# Altium schematic sheet BCR.SchDoc
size A2; Author: H. Chesser; DrawnBy: H. Chesser
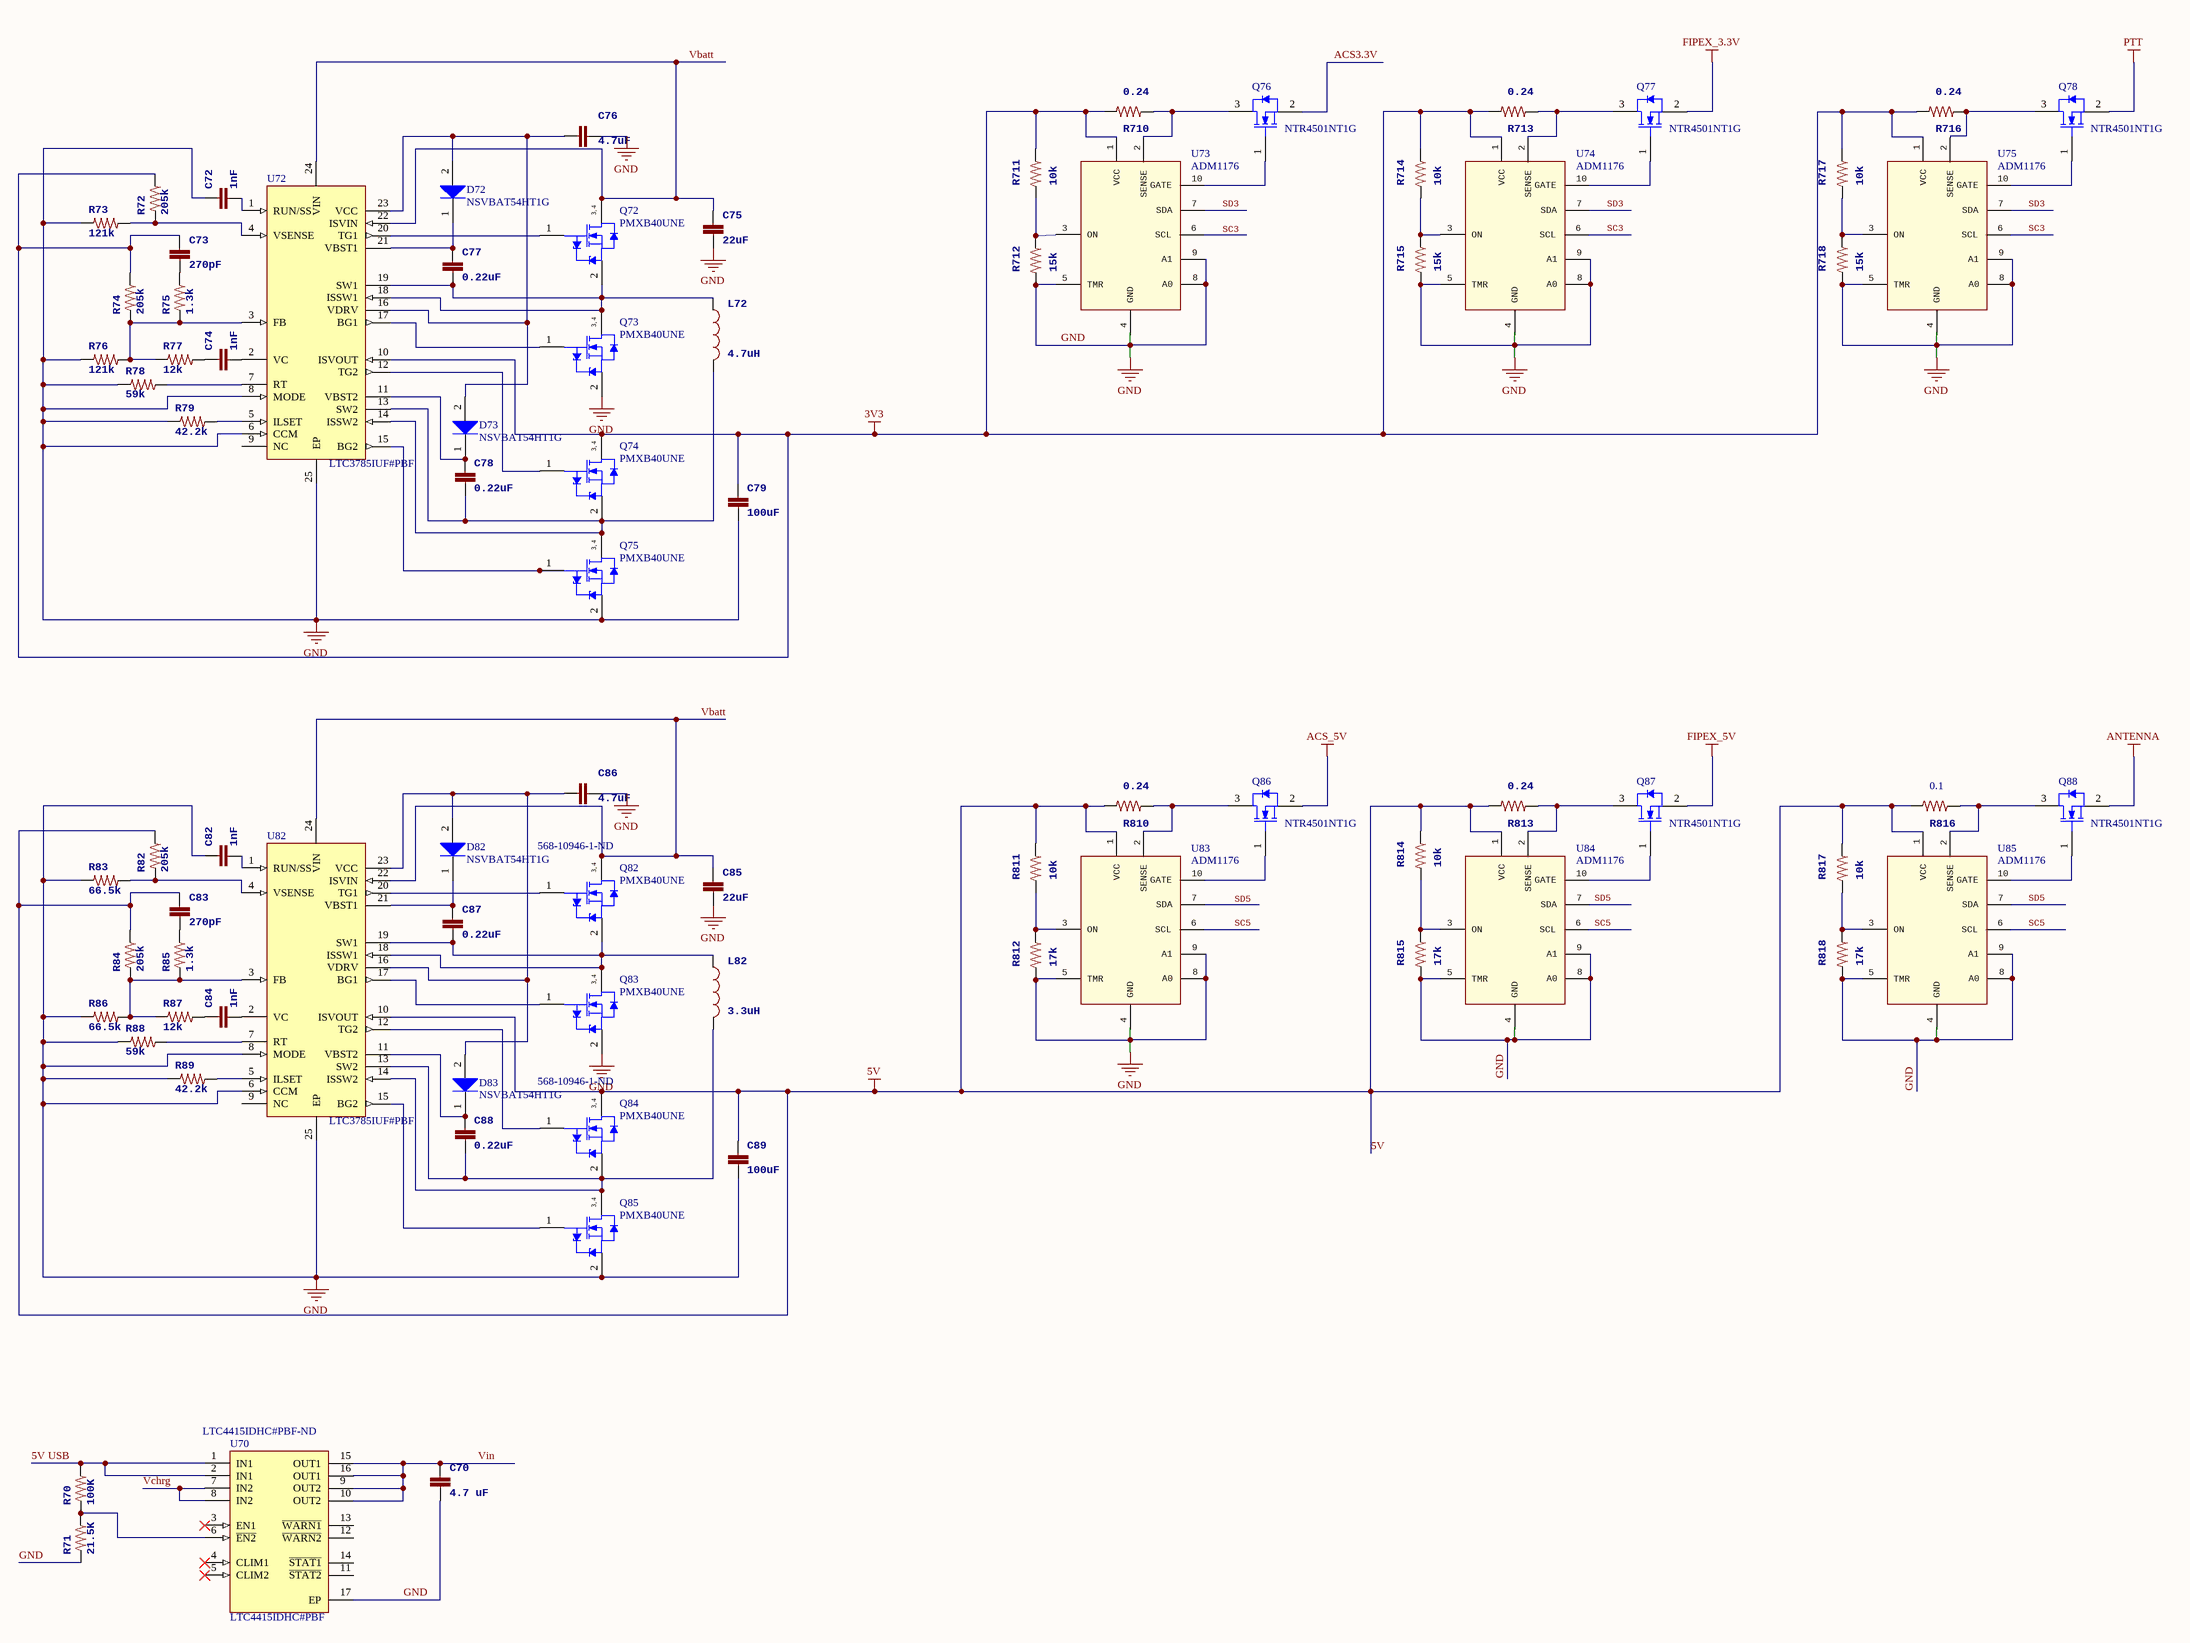
[diagram p0: BCR.SchDoc]

## Parts
C70  4.7 uF  [0805]
C72  1nF  [0402-CAP]
C73  270pF  [0402-CAP]
C74  1nF  [0402-CAP]
C75  22uF  [0805]
C76  4.7uF  [0805]
C77  0.22uF  [0805]
C78  0.22uF  [0805]
C79  100uF  [0805]
C82  1nF  [0402-CAP]
C83  270pF  [0402-CAP]
C84  1nF  [0402-CAP]
C85  22uF  [0805]
C86  4.7uF  [0805]
C87  0.22uF  [0805]
C88  0.22uF  [0805]
C89  100uF  [0805]
D72  NSVBAT54HT1G  [ONSC-SOD-323-2-477-02_V]
D73  NSVBAT54HT1G  [ONSC-SOD-323-2-477-02_V]
D82  NSVBAT54HT1G  [ONSC-SOD-323-2-477-02_V]
D83  NSVBAT54HT1G  [ONSC-SOD-323-2-477-02_V]
L72  4.7uH  [1007]
L82  3.3uH  [1007]
Q72  PMXB40UNE  [NXP-SOT1215_M]
Q73  PMXB40UNE  [NXP-SOT1215_M]
Q74  PMXB40UNE  [NXP-SOT1215_M]
Q75  PMXB40UNE  [NXP-SOT1215_M]
Q76  NTR4501NT1G  [ONSC-SOT-23-3-318-08_V]
Q77  NTR4501NT1G  [ONSC-SOT-23-3-318-08_V]
Q78  NTR4501NT1G  [ONSC-SOT-23-3-318-08_V]
Q82  PMXB40UNE  Supplier Part Number 1: 568-10946-1-ND  [NXP-SOT1215_M]
Q83  PMXB40UNE  [NXP-SOT1215_M]
Q84  PMXB40UNE  Supplier Part Number 1: 568-10946-1-ND  [NXP-SOT1215_M]
Q85  PMXB40UNE  [NXP-SOT1215_M]
Q86  NTR4501NT1G  [ONSC-SOT-23-3-318-08_V]
Q87  NTR4501NT1G  [ONSC-SOT-23-3-318-08_V]
Q88  NTR4501NT1G  [ONSC-SOT-23-3-318-08_V]
R70  100K  [0805]
R71  21.5K  [0805]
R72  205k  [0603-RES]
R73  121k  [0603-RES]
R74  205k  [0603-RES]
R75  1.3k  [0603-RES]
R76  121k  [0603-RES]
R77  12k  [0603-RES]
R78  59k  [0603-RES]
R79  42.2k  [0603-RES]
R82  205k  [0603-RES]
R83  66.5k  [0603-RES]
R84  205k  [0603-RES]
R85  1.3k  [0603-RES]
R86  66.5k  [0603-RES]
R87  12k  [0603-RES]
R88  59k  [0603-RES]
R89  42.2k  [0603-RES]
R710  0.24  [RESC1220X06N]
R711  10k  [0603-RES]
R712  15k  [0603-RES]
R713  0.24  [RESC1220X06N]
R714  10k  [0603-RES]
R715  15k  [0603-RES]
R716  0.24  [RESC1220X06N]
R717  10k  [0603-RES]
R718  15k  [0603-RES]
R810  0.24  [RESC1220X06N]
R811  10k  [0603-RES]
R812  17k  [0603-RES]
R813  0.24  [RESC1220X06N]
R814  10k  [0603-RES]
R815  17k  [0603-RES]
R816  value 0.1  [0603-RES]  (hidden comment: 0603)
R817  10k  [0603-RES]
R818  17k  [0603-RES]
U70  LTC4415IDHC#PBF  Supplier Part Number 1: LTC4415IDHC#PBF-ND  [LT-DHC-16_A_V]
U72  LTC3785IUF#PBF  [LT-UF-24_M]
U73  ADM1176  [MSOP-10]
U74  ADM1176  [MSOP-10]
U75  ADM1176  [MSOP-10]
U82  LTC3785IUF#PBF  [LT-UF-24_M]
U83  ADM1176  [MSOP-10]
U84  ADM1176  [MSOP-10]
U85  ADM1176  [MSOP-10]

## Nets
3V3: C73.1 C79.1 Q74.3(D) Q74.4(D) R72.2 R74.2 R710.2 R711.2 R713.2 R714.2 R716.2 R717.2 U72.10(ISVOUT) U73.1(VCC) U74.1(VCC) U75.1(VCC)
5V: C83.1 C89.1 Q84.3(D) Q84.4(D) R82.2 R84.2 R810.2 R811.2 R813.2 R814.2 R816.2 R817.2 U82.10(ISVOUT) U83.1(VCC) U84.1(VCC) U85.1(VCC)
ACS_5V: Q86.2(S)
ANTENNA: Q88.2(S)
FIPEX_3.3V: Q77.2(S)
FIPEX_5V: Q87.2(S)
GND: C70.2 C72.1 C75.2 C76.2 C79.2 C82.1 C85.2 C86.2 C89.2 Q73.2(S) Q75.2(S) Q83.2(S) Q85.2(S) R71.1 R73.1 R76.1 R78.1 R79.1 R83.1 R86.1 R88.1 R89.1 R712.1 R715.1 R718.1 R812.1 R815.1 R818.1 U70.17(EP) U72.6(CCM) U72.8(MODE) U72.25(EP) U73.4(GND) U73.5(TMR) U73.8(A0) U73.9(A1) U74.4(GND) U74.5(TMR) U74.8(A0) U74.9(A1) U75.4(GND) U75.5(TMR) U75.8(A0) U75.9(A1) U82.6(CCM) U82.8(MODE) U82.25(EP) U83.4(GND) U83.5(TMR) U83.8(A0) U83.9(A1) U84.4(GND) U84.5(TMR) U84.8(A0) U84.9(A1) U85.4(GND) U85.5(TMR) U85.8(A0) U85.9(A1)
PTT: Q78.2(S)
5V USB: R70.2 U70.1(IN1) U70.2(IN1)
ACS3.3V: Q76.2(S)
SC3: U74.6(SCL) U75.6(SCL)
SC5: U83.6(SCL) U84.6(SCL) U85.6(SCL)
SD3: U73.7(SDA) U74.7(SDA) U75.7(SDA)
SD5: U84.7(SDA) U85.7(SDA)
Vbatt: C75.1 C85.1 Q72.3(D) Q72.4(D) Q82.3(D) Q82.4(D) U72.22(ISVIN) U72.24(VIN) U82.22(ISVIN) U82.24(VIN)
Vchrg: U70.7(IN2) U70.8(IN2)
Vin: C70.1 U70.9(OUT2) U70.10(OUT2) U70.15(OUT1) U70.16(OUT1)
NetC72_2: C72.2 U72.1(RUN/SS)
NetC73_2: C73.2 R75.2
NetC74_1: C74.1 R77.2
NetC74_2: C74.2 U72.2(VC)
NetC76_1: C76.1 D72.2(A) D73.2(A) U72.16(VDRV) U72.23(VCC)
NetC77_1: C77.1 D72.1(K) U72.21(VBST1)
NetC77_2: C77.2 L72.1 Q72.2(S) Q73.3(D) Q73.4(D) U72.18(ISSW1) U72.19(SW1)
NetC78_1: C78.1 D73.1(K) U72.11(VBST2)
NetC78_2: C78.2 L72.2 Q74.2(S) Q75.3(D) Q75.4(D) U72.13(SW2) U72.14(ISSW2)
NetC82_2: C82.2 U82.1(RUN/SS)
NetC83_2: C83.2 R85.2
NetC84_1: C84.1 R87.2
NetC84_2: C84.2 U82.2(VC)
NetC86_1: C86.1 D82.2(A) D83.2(A) U82.16(VDRV) U82.23(VCC)
NetC87_1: C87.1 D82.1(K) U82.21(VBST1)
NetC87_2: C87.2 L82.1 Q82.2(S) Q83.3(D) Q83.4(D) U82.18(ISSW1) U82.19(SW1)
NetC88_1: C88.1 D83.1(K) U82.11(VBST2)
NetC88_2: C88.2 L82.2 Q84.2(S) Q85.3(D) Q85.4(D) U82.13(SW2) U82.14(ISSW2)
NetQ72_1: Q72.1(G) U72.20(TG1)
NetQ73_1: Q73.1(G) U72.17(BG1)
NetQ74_1: Q74.1(G) U72.12(TG2)
NetQ75_1: Q75.1(G) U72.15(BG2)
NetQ76_1: Q76.1(G) U73.10(GATE)
NetQ76_3: Q76.3(D) R710.1 U73.2(SENSE)
NetQ77_1: Q77.1(G) U74.10(GATE)
NetQ77_3: Q77.3(D) R713.1 U74.2(SENSE)
NetQ78_1: Q78.1(G) U75.10(GATE)
NetQ78_3: Q78.3(D) R716.1 U75.2(SENSE)
NetQ82_1: Q82.1(G) U82.20(TG1)
NetQ83_1: Q83.1(G) U82.17(BG1)
NetQ84_1: Q84.1(G) U82.12(TG2)
NetQ85_1: Q85.1(G) U82.15(BG2)
NetQ86_1: Q86.1(G) U83.10(GATE)
NetQ86_3: Q86.3(D) R810.1 U83.2(SENSE)
NetQ87_1: Q87.1(G) U84.10(GATE)
NetQ87_3: Q87.3(D) R813.1 U84.2(SENSE)
NetQ88_1: Q88.1(G) U85.10(GATE)
NetQ88_3: Q88.3(D) R816.1 U85.2(SENSE)
NetR70_1: R70.1 R71.2 U70.6(~{EN2})
NetR72_1: R72.1 R73.2 U72.4(VSENSE)
NetR74_1: R74.1 R75.1 R76.2 R77.1 U72.3(FB)
NetR78_2: R78.2 U72.7(RT)
NetR79_2: R79.2 U72.5(ILSET)
NetR82_1: R82.1 R83.2 U82.4(VSENSE)
NetR84_1: R84.1 R85.1 R86.2 R87.1 U82.3(FB)
NetR88_2: R88.2 U82.7(RT)
NetR89_2: R89.2 U82.5(ILSET)
NetR711_1: R711.1 R712.2 U73.3(ON)
NetR714_1: R714.1 R715.2 U74.3(ON)
NetR717_1: R717.1 R718.2 U75.3(ON)
NetR811_1: R811.1 R812.2 U83.3(ON)
NetR814_1: R814.1 R815.2 U84.3(ON)
NetR817_1: R817.1 R818.2 U85.3(ON)

Not connected (* = marked no-connect by the designer): U70 3(EN1)* 4(CLIM1)* 5(CLIM2)* 11(~{STAT2}) 12(~{WARN2}) 13(~{WARN1}) 14(~{STAT1}); U72 9(NC); U73 6(SCL); U82 9(NC); U83 7(SDA)

## Notes on the sheet
- Labels drawn without touching a wire or pin: SC3, SD5
- (in symbol CMP-1258-00046-1) 3, 4

## Library data of the parts
C70 = CAP0805_4700nF: Tolerance: ±10%; Voltage - Rated: 10V; Temperature Coefficient: X5R; RoHS: RoHS Compliant; Category: Capacitors; Packaging: Tape & Reel (TR); Mounting Type: Surface Mount, MLCC; Operating Temperature: -55°C ~ 125°C; Applications: General Purpose; Ratings: -; Package / Case: 0805 (2012 Metric); Size / Dimension: 0.079" L x 0.049" W (2.00mm x 1.25mm); Thickness (Max): 0.039" (1.00mm); Value: 4.7 uF; Supplier 1: Digi-Key; Supplier Part Number 1: 709-1230-1-ND
C72-C74 C82-C84 = CAP0402-CAP: Supplier 1: Digi-Key
  C72 C74 C82 C84: Supplier Part Number 1: 490-1303-1-ND
  C73 C83: Supplier Part Number 1: 1276-1673-1-ND
C75-C79 C85-C89 = CAP0805: Manufacturer: Kemet; Manufacturer Part Number: C0805C105K8RACTU; Tolerance: ±10%; Voltage - Rated: 10V; Temperature Coefficient: X7R; RoHS: RoHS Compliant; Category: Capacitors; Packaging: Tape & Reel (TR); Mounting Type: Surface Mount, MLCC; Operating Temperature: -55°C ~ 125°C; Applications: General Purpose; Ratings: -; Package / Case: 0805 (2012 Metric); Size / Dimension: 0.079" L x 0.049" W (2.00mm x 1.25mm); Height - Seated (Max): -; Thickness (Max): 0.039" (1.00mm); Lead Spacing: -; Features: -; Lead Style: -; ComponentLink1URL: http://www.kemet.com/docfinder?Partnumber=C0805C105K8RACTU; ComponentLink1Description: http://www.kemet.com/docfinder?Partnumber=C0805C105K8RACTU; Supplier 1: Digi-Key
  C75 C85: Supplier Part Number 1: 490-1719-1-ND
  C76 C86: Supplier Part Number 1: 490-3338-1-ND
  C77 C78 C87 C88: Supplier Part Number 1: 490-1670-1-ND
  C79 C89: Supplier Part Number 1: 490-10510-1-ND
D72 D73 D82 D83 = CMP-1055-00464-1: Schottky Barrier Diode, 2-Pin SOD-323, Pb-Free, Tape and Reel; Manufacturer: On Semiconductor; Configuration: Single; IFSM Max (A): 0.6; trr Max (ns): 5; ComponentLink1URL: http://www.onsemi.com/; ComponentLink2URL: http://www.onsemi.cn/pub_link/Collateral/BAT54HT1-D.PDF; ComponentLink2Description: Datasheet; PackageReference: SOD-323-2-477-02; ComponentLink3URL: http://www.onsemi.com/pub_link/Collateral/477-02.PDF.1; Mounting Technology: Surface Mount; DatasheetVersion: Rev. 6; PartNumber: NSVBAT54HT1G; ComponentLink3Description: Package Specification; PackageDescription: 2-Pin SOD, Body 1.7 x 1.25 mm; RoHS: TRUE; PackageVersion: Rev. H, 03/2007; Packing: Tape and Reel; ComponentLink1Description: Manufacturer URL; Supplier 1: Digi-Key; Supplier Part Number 1: NSVBAT54HT1GOSCT-ND
L72 L82 = INDUCTOR1007: Supplier 1: Digi-Key
  L72: Supplier Part Number 1: 587-1621-1-ND
  L82: Supplier Part Number 1: 587-2186-1-ND
Q72-Q75 Q82-Q85 = CMP-1258-00046-1: N-Channel Trench MOSFET, 12 V, 3.2 A, -55 to 150 degC, 4-Pin SOT1215; PartNumber: PMXB40UNEZ; Manufacturer: NXP Semiconductors; VDS [max] (V): 12; Coss [typ] (pF): 107; Ciss [typ] (pF): 556; Channel Type: N; VGSth [typ] (V): 0.65; ID [max] (A): 3.2; ComponentLink1URL: http://www.nxp.com/; PackageVersion: 13-03-06, 03/2013; ComponentLink2URL: http://www.nxp.com/documents/data_sheet/PMXB40UNE.pdf; PackageReference: SOT1215; Mounting Technology: Surface Mount; ComponentLink2Description: Datasheet; ComponentLink3URL: http://www.nxp.com/documents/outline_drawing/sot1215_po.pdf; ComponentLink3Description: Package Specification; PackageDescription: 3-Pin Small Outline No-Lead, Body 1.1 x 1 mm, Pitch 0.75 mm; ComponentLink1Description: Manufacturer URL; DatasheetVersion: Rev. 1; Supplier 1: Digi-Key
  Q72-Q75 Q83 Q85: Supplier Part Number 1: 568-10946-1-ND
Q76-Q78 Q86-Q88 = CMP-1058-00732-1: Power MOSFET, 20 V, 3.2 A, Single N-Channel, 3-Pin SOT-23, Pb-Free, Tape and Reel; Manufacturer: On Semiconductor; VGS Max (V): 12; VGS(th) Max (V): 1.2; PD Max (W): 1.25; Coss Typ (pF): 80; Ciss Typ (pF): 200; V(BR)DSS Min (V): 20; Qrr Typ (nC): 3; Crss Typ (pF): 50; Channel Polarity: N Channel; RoHS: Pb-Free; ComponentLink3URL: http://www.onsemi.cn/pub_link/Collateral/318-08.PDF; ComponentLink2Description: Datasheet; PackageVersion: Rev. AP, 11/2009; Mounting Technology: Surface Mount; PackageDescription: 3-Pin Small Outline Transistor, Body 2.92 x 1.3 mm, Pitch 0.95 mm; PackageReference: SOT-23-3-318-08; ComponentLink1URL: http://www.onsemi.com/; Packing: Tape and Reel; Configuration: Single; ComponentLink2URL: http://www.onsemi.cn/pub_link/Collateral/NTR4501N-D.PDF; ComponentLink3Description: Package Specification; Package Type: SOT-23-3; ComponentLink1Description: Manufacturer URL; PartNumber: NTR4501NT1G; DatasheetVersion: Rev. 13; Supplier 1: Digi-Key; Supplier Part Number 1: NTR4501NT1GOSCT-ND
R70 = RES_0805_100K: Manufacturer: TE Connectivity; Manufacturer Part Number: 1625856-2; Resistance (Ohms): 10K; Tolerance: ±10%; Power (Watts): 0.125W, 1/8W; Temperature Coefficient: ±100ppm/°C; RoHS: RoHS Compliant; Category: Resistors; Packaging: Cut Tape (CT); Composition: Thick Film; Features: -; Operating Temperature: -55°C ~ 125°C; Package / Case: 0805 (2012 Metric); Supplier Device Package: 0805; Size / Dimension: 0.079" L x 0.047" W (2.00mm x 1.20mm); Height: 0.020" (0.50mm); Number of Terminations: 2; ComponentLink1URL: http://www.te.com/commerce/DocumentDelivery/DDEController?Action=srchrtrv&DocNm=1625856&DocType=Customer+Drawing&DocLang=English; ComponentLink1Description: http://www.te.com/commerce/DocumentDelivery/DDEController?Action=srchrtrv&DocNm=1625856&DocType=Customer+Drawing&DocLang=English; Value: 100K; Supplier 1: Digi-Key; Supplier Part Number 1: 311-100KCRCT-ND
R71 = RES_0805_21_5K: Manufacturer: TE Connectivity; Manufacturer Part Number: 1625856-2; Resistance (Ohms): 15K; Tolerance: ±10%; Power (Watts): 0.125W, 1/8W; Temperature Coefficient: ±100ppm/°C; RoHS: RoHS Compliant; Category: Resistors; Packaging: Cut Tape (CT); Composition: Thick Film; Features: -; Operating Temperature: -55°C ~ 125°C; Package / Case: 0805 (2012 Metric); Supplier Device Package: 0805; Size / Dimension: 0.079" L x 0.047" W (2.00mm x 1.20mm); Height: 0.020" (0.50mm); Number of Terminations: 2; ComponentLink1URL: http://www.te.com/commerce/DocumentDelivery/DDEController?Action=srchrtrv&DocNm=1625856&DocType=Customer+Drawing&DocLang=English; ComponentLink1Description: http://www.te.com/commerce/DocumentDelivery/DDEController?Action=srchrtrv&DocNm=1625856&DocType=Customer+Drawing&DocLang=English; Value: 21.5K; Supplier 1: Digi-Key; Supplier Part Number 1: 541-21.5KCCT-ND
R72-R79 R82-R89 R710-R718 R810-R815 R817 R818 = RESISTOR0603-RES: Supplier 1: Digi-Key
  R72 R74: Supplier Part Number 1: P205KHTR-ND
  R73 R76: Supplier Part Number 1: P121KHTR-ND
  R75 R85: Supplier Part Number 1: P1.30KHTR-ND
  R77: Supplier Part Number 1: P12.0KHTR-ND
  R78: Supplier Part Number 1: P59.0KHTR-ND
  R79 R89: Supplier Part Number 1: P42.2KHTR-ND
  R82: Supplier Part Number 1: P205KHCT-ND
  R83: Supplier Part Number 1: P66.5KHTR-ND
  R84: Supplier Part Number 1: P205KHDKR-ND
  R86: Supplier Part Number 1: P66.5KHCT-ND
  R87: Supplier Part Number 1: P12.0KHCT-ND
  R88: Supplier Part Number 1: P59.0KHCT-ND
  R710 R713 R716 R810 R813: Supplier Part Number 1: P16011TR-ND
  R711 R714 R717 R811 R814 R817: Supplier Part Number 1: P10.0KHTR-ND
  R712 R715 R718: Supplier Part Number 1: P15.0KHTR-ND
  R812 R818: Supplier Part Number 1: P16.9KHCT-ND
  R815: Supplier Part Number 1: P16.9KHTR-ND
R816 = RESISTOR0603-RES: =Value; Supplier 1: Digi-Key; Supplier Part Number 1: 311-.10QCT-ND
U70 = CMP-0479-00074-1: Dual 4 A Ideal Diode with Adjustable Current Limit, Imon Output, Overcurrent Warning, Thermal Warning, 1.7 to 5.5 V Vin, 16-pin DFN (DHC-16_A), -40 to 125 degC, Pb-Free; Manufacturer: Linear Technology; Ideal Diode: Dual, Internal, P-Channel; Code_JEDEC: MO-229; ComponentLink3URL: http://cds.linear.com/docs/en/datasheet/4415fa.pdf; ComponentLink2URL: http://cds.linear.com/docs/en/datasheet/4415fa.pdf; Mounting Technology: Surface Mount; PackageDescription: 16-Pin Plastic DFN, Body 5 x 3 mm, Pitch 0.5 mm; ComponentLink1Description: Manufacturer URL; ComponentLink1URL: http://www.linear.com/; PackageVersion: Rev. Ø; PartNumber: LTC4415IDHC#PBF; PackageReference: DHC-16; ComponentLink3Description: Package Specification; DatasheetVersion: Rev. Ø; ComponentLink2Description: Datasheet; RoHS: TRUE; Supplier 1: Digi-Key
U72 U82 = CMP-0492-02264-1: High Efficiency, Synchronous, No Rsense Buck-Boost Controller, 24-pin QFN (UF24), -40 to 125 degC, Pb-Free; Manufacturer: Linear Technology; Number of Outputs: 1; Code_JEDEC: MO-220; PartNumber: LTC3785IUF#PBF; ComponentLink1Description: Manufacturer URL; PackageReference: UF24; ComponentLink3Description: Package Specification; PackageDescription: 24-Pin Plastic QFN, Body 4 x 4 mm, Pitch 0.5 mm; PackageVersion: Rev. B, 02/2012; ComponentLink1URL: http://www.linear.com/; ComponentLink3URL: http://cds.linear.com/docs/en/packaging/%28UF24%29%20QFN%2005-08-1697%20Rev%20B.pdf; ComponentLink2Description: Datasheet; DatasheetVersion: Rev. C; ComponentLink2URL: http://cds.linear.com/docs/en/datasheet/3785fc.pdf; RoHS: TRUE; Mounting Technology: Surface Mount; Supplier 1: Digi-Key; Supplier Part Number 1: LTC3785IUF#PBF-ND
U73-U75 U83-U85 = ADM1176: DataSheet: http://www.analog.com/static/imported-files/data_sheets/ADM1176.pdf; MPN: ADM1176; Supplier 1: Digi-Key; Supplier Part Number 1: ADM1176-1ARMZ-R7CT-ND